# EAGLE design STM_TEST (EAGLE 8.6.1)

## Sheet 1 of 3: STM, EEPROM, CAN TRANCIEVER
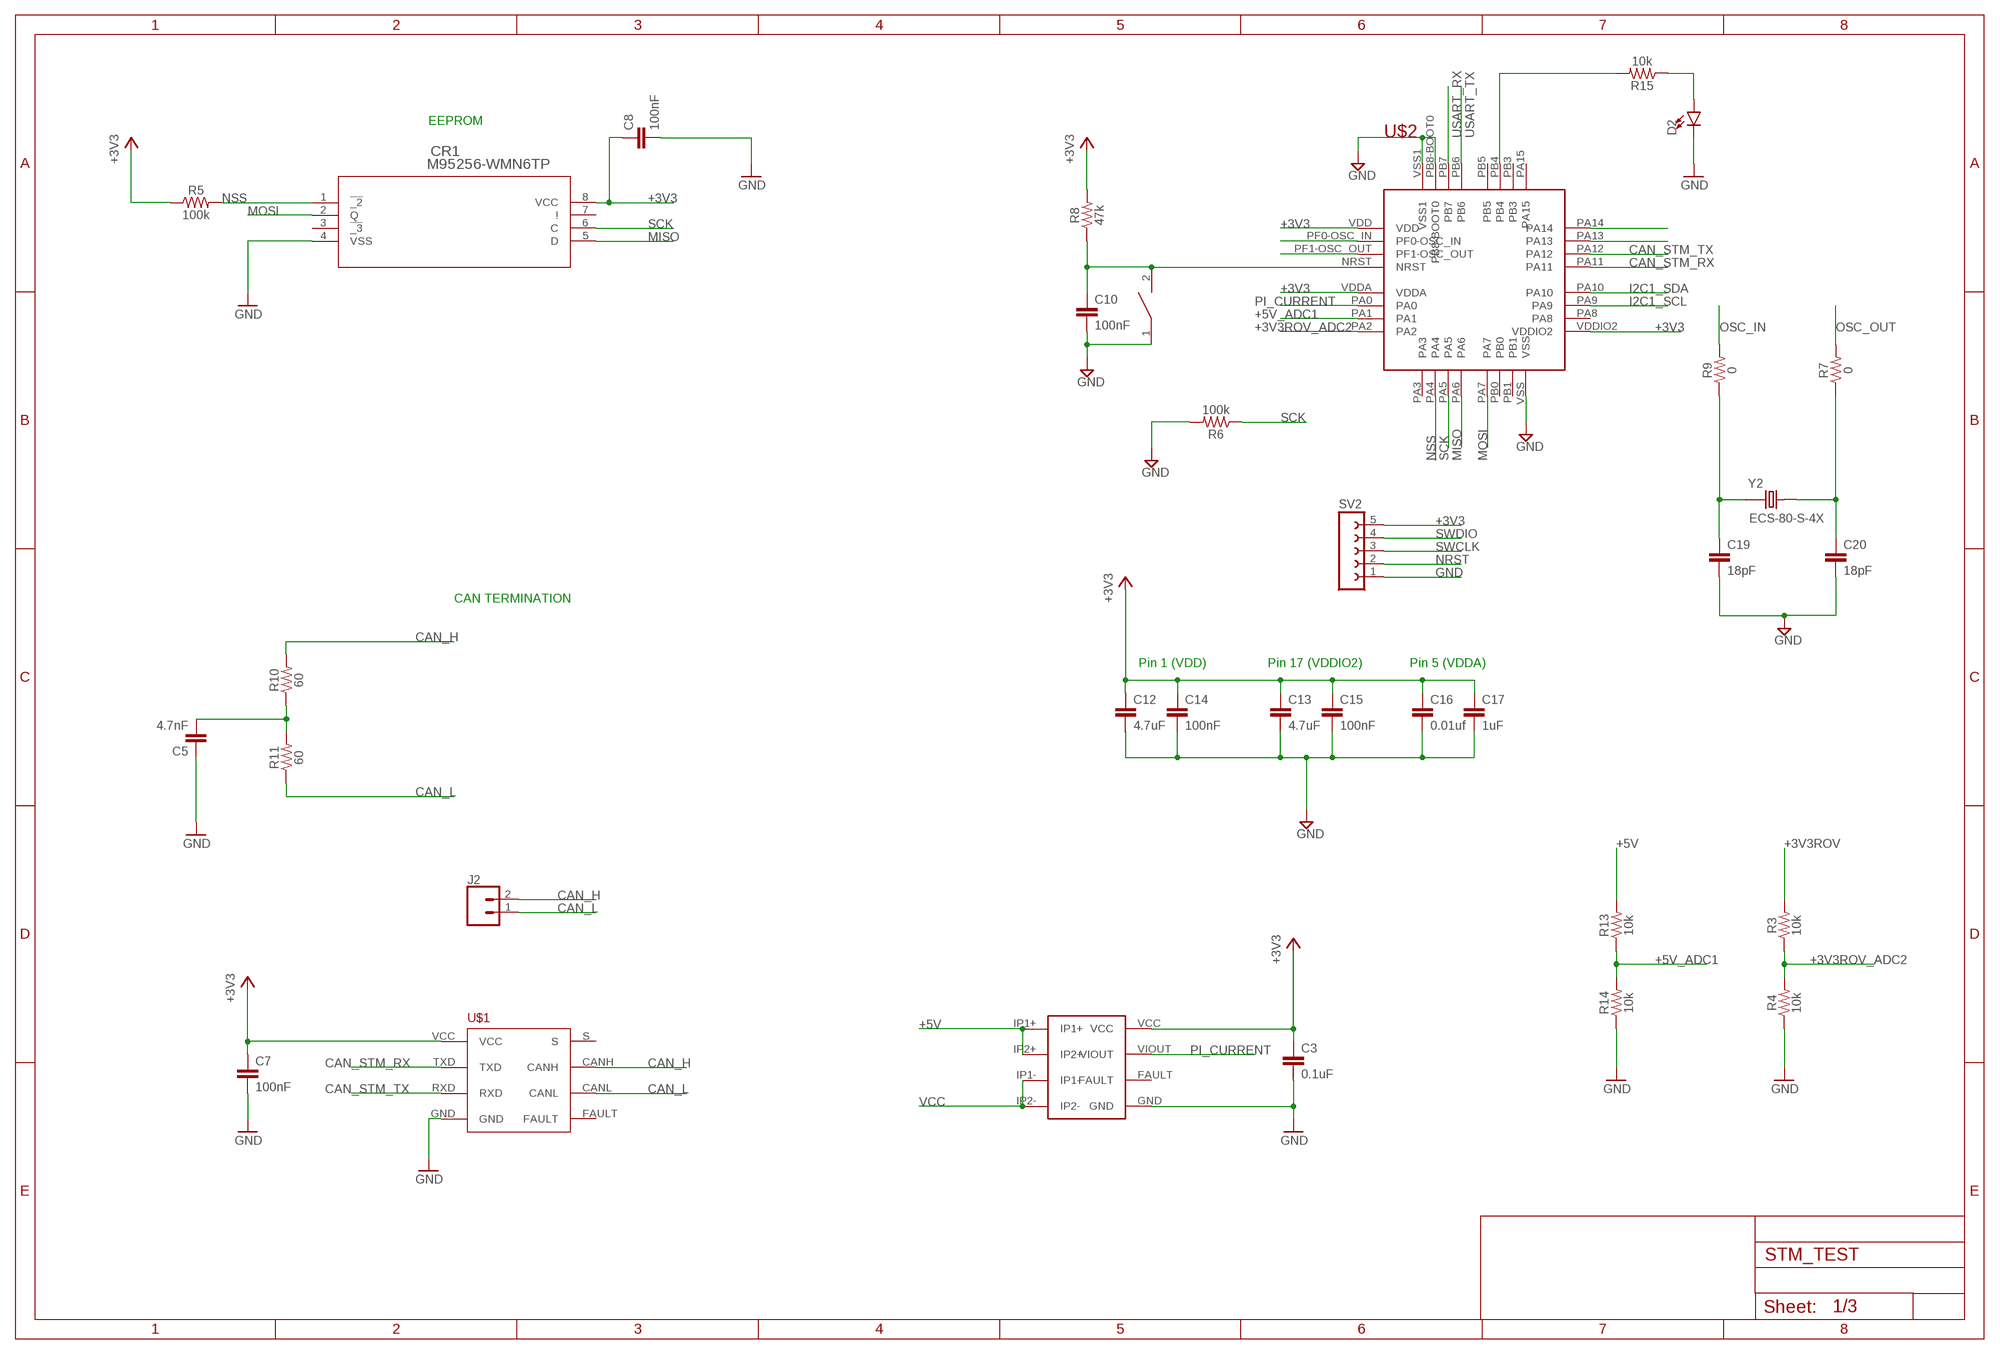
[diagram p0: schematic, sheet 1]

### Parts
C3  0.1uF  4.7UF0603  [0603]
C5  4.7nF  0.1UF-0603-25V-(+80/-20%)  [0603]
C7  100nF  4.7UF0603  [0603]
C8  100nF  4.7UF0603  [0603]
C10  100nF  4.7UF0603  [0603]
C12  4.7uF  4.7UF0603  [0603]
C13  4.7uF  4.7UF0603  [0603]
C14  100nF  4.7UF0603  [0603]
C15  100nF  4.7UF0603  [0603]
C16  0.01uf  4.7UF0603  [0603]
C17  1uF  4.7UF0603  [0603]
C19  18pF  4.7UF0603  [0603]
C20  18pF  4.7UF0603  [0603]
CR1  M95256-WMN6TP  [SO-8]
D2  LED0603  [LED-0603]
J2  CONN_02  [1X02]
R3  10k  1KOHM-0603-1/10W-1%  [0603]
R4  10k  1KOHM-0603-1/10W-1%  [0603]
R5  100k  1KOHM-0603-1/10W-1%  [0603]
R6  100k  1KOHM-0603-1/10W-1%  [0603]
R7  0  1KOHM-0603-1/10W-1%  [0603]
R8  47k  1KOHM-0603-1/10W-1%  [0603]
R9  0  1KOHM-0603-1/10W-1%  [0603]
R10  60  1KOHM-0603-1/10W-1%  [0603]
R11  60  1KOHM-0603-1/10W-1%  [0603]
R13  10k  1KOHM-0603-1/10W-1%  [0603]
R14  10k  1KOHM-0603-1/10W-1%  [0603]
R15  10k  100KOHM-0603-1/10W-1%  [0603]
RESET1  SWITCH  [SW_2512]
SV2  FE05-1  [FE05-1]
U$1  TCAN337D  [TCAN337D]
U$2  STM32F042K6T6  [STM32F042K6T6]
U$4  ACS711  [ACS711]
Y2  ECS-80-S-4X  [XTAL_ECS-80-S-4X]

### Nets
+3V3: C3.1 C7.1 C8.1 C12.1 C13.1 C14.1 C15.1 C16.1 C17.1 CR1.8(VCC) R5.1 R8.2 SV2.5 U$1.VCC U$2.VDD U$2.VDDA U$2.VDDIO2 U$4.VCC ; also sheet 2,3
+3V3ROV: R3.2 ; also sheet 2
+3V3ROV_ADC2: R3.1 R4.2 U$2.PA2
+5V: R13.2 U$4.IP1+ U$4.IP2+ ; also sheet 3
+5V_ADC1: R13.1 R14.2 U$2.PA1
CAN_H: J2.2 R10.2 U$1.CANH ; also sheet 3
CAN_L: J2.1 R11.1 U$1.CANL ; also sheet 3
CAN_STM_RX: U$1.TXD U$2.PA11
CAN_STM_TX: U$1.RXD U$2.PA12
GND: C3.2 C5.1 C7.2 C8.2 C10.2 C12.2 C13.2 C14.2 C15.2 C16.2 C17.2 C19.2 C20.2 CR1.4(VSS) D2.C R4.1 R6.2 R14.1 RESET1.1 SV2.1 U$1.GND U$2.PB8-BOOT0 U$2.VSS U$2.VSS1 U$4.GND ; also sheet 2,3
I2C1_SCL: U$2.PA9 ; also sheet 3
I2C1_SDA: U$2.PA10 ; also sheet 3
MISO: CR1.5(D) U$2.PA6
MOSI: CR1.2(Q) U$2.PA7
N$1: C5.2 R10.1 R11.2
N$4: D2.A R15.1
N$5: R15.2 U$2.PB4
N$6: C20.1 R7.1 Y2.2
N$7: C19.1 R9.1 Y2.1
NRST: C10.1 R8.1 RESET1.2 SV2.2 U$2.NRST
NSS: CR1.1(!_2) R5.2 U$2.PA4
OSC_IN: R9.2 U$2.PF0-OSC_IN
OSC_OUT: R7.2 U$2.PF1-OSC_OUT
PI_CURRENT: U$2.PA0 U$4.VIOUT
SCK: CR1.6(C) R6.1 U$2.PA5
SWCLK: SV2.3 U$2.PA14
SWDIO: SV2.4 U$2.PA13
USART_RX: U$2.PB7 ; also sheet 3
USART_TX: U$2.PB6 ; also sheet 3
VCC: U$4.IP1- U$4.IP2- ; also sheet 2
Unconnected: CR1.3(!_3) CR1.7(!) U$1.FAULT U$1.S U$2.PA3 U$2.PA8 U$2.PA15 U$2.PB0 U$2.PB1 U$2.PB3 U$2.PB5 U$4.FAULT

### Notes on the sheet
- EEPROM
- CAN TERMINATION
- Pin 1 (VDD) | Pin 17 (VDDIO2) | Pin 5 (VDDA)

## Sheet 2 of 3: POWER
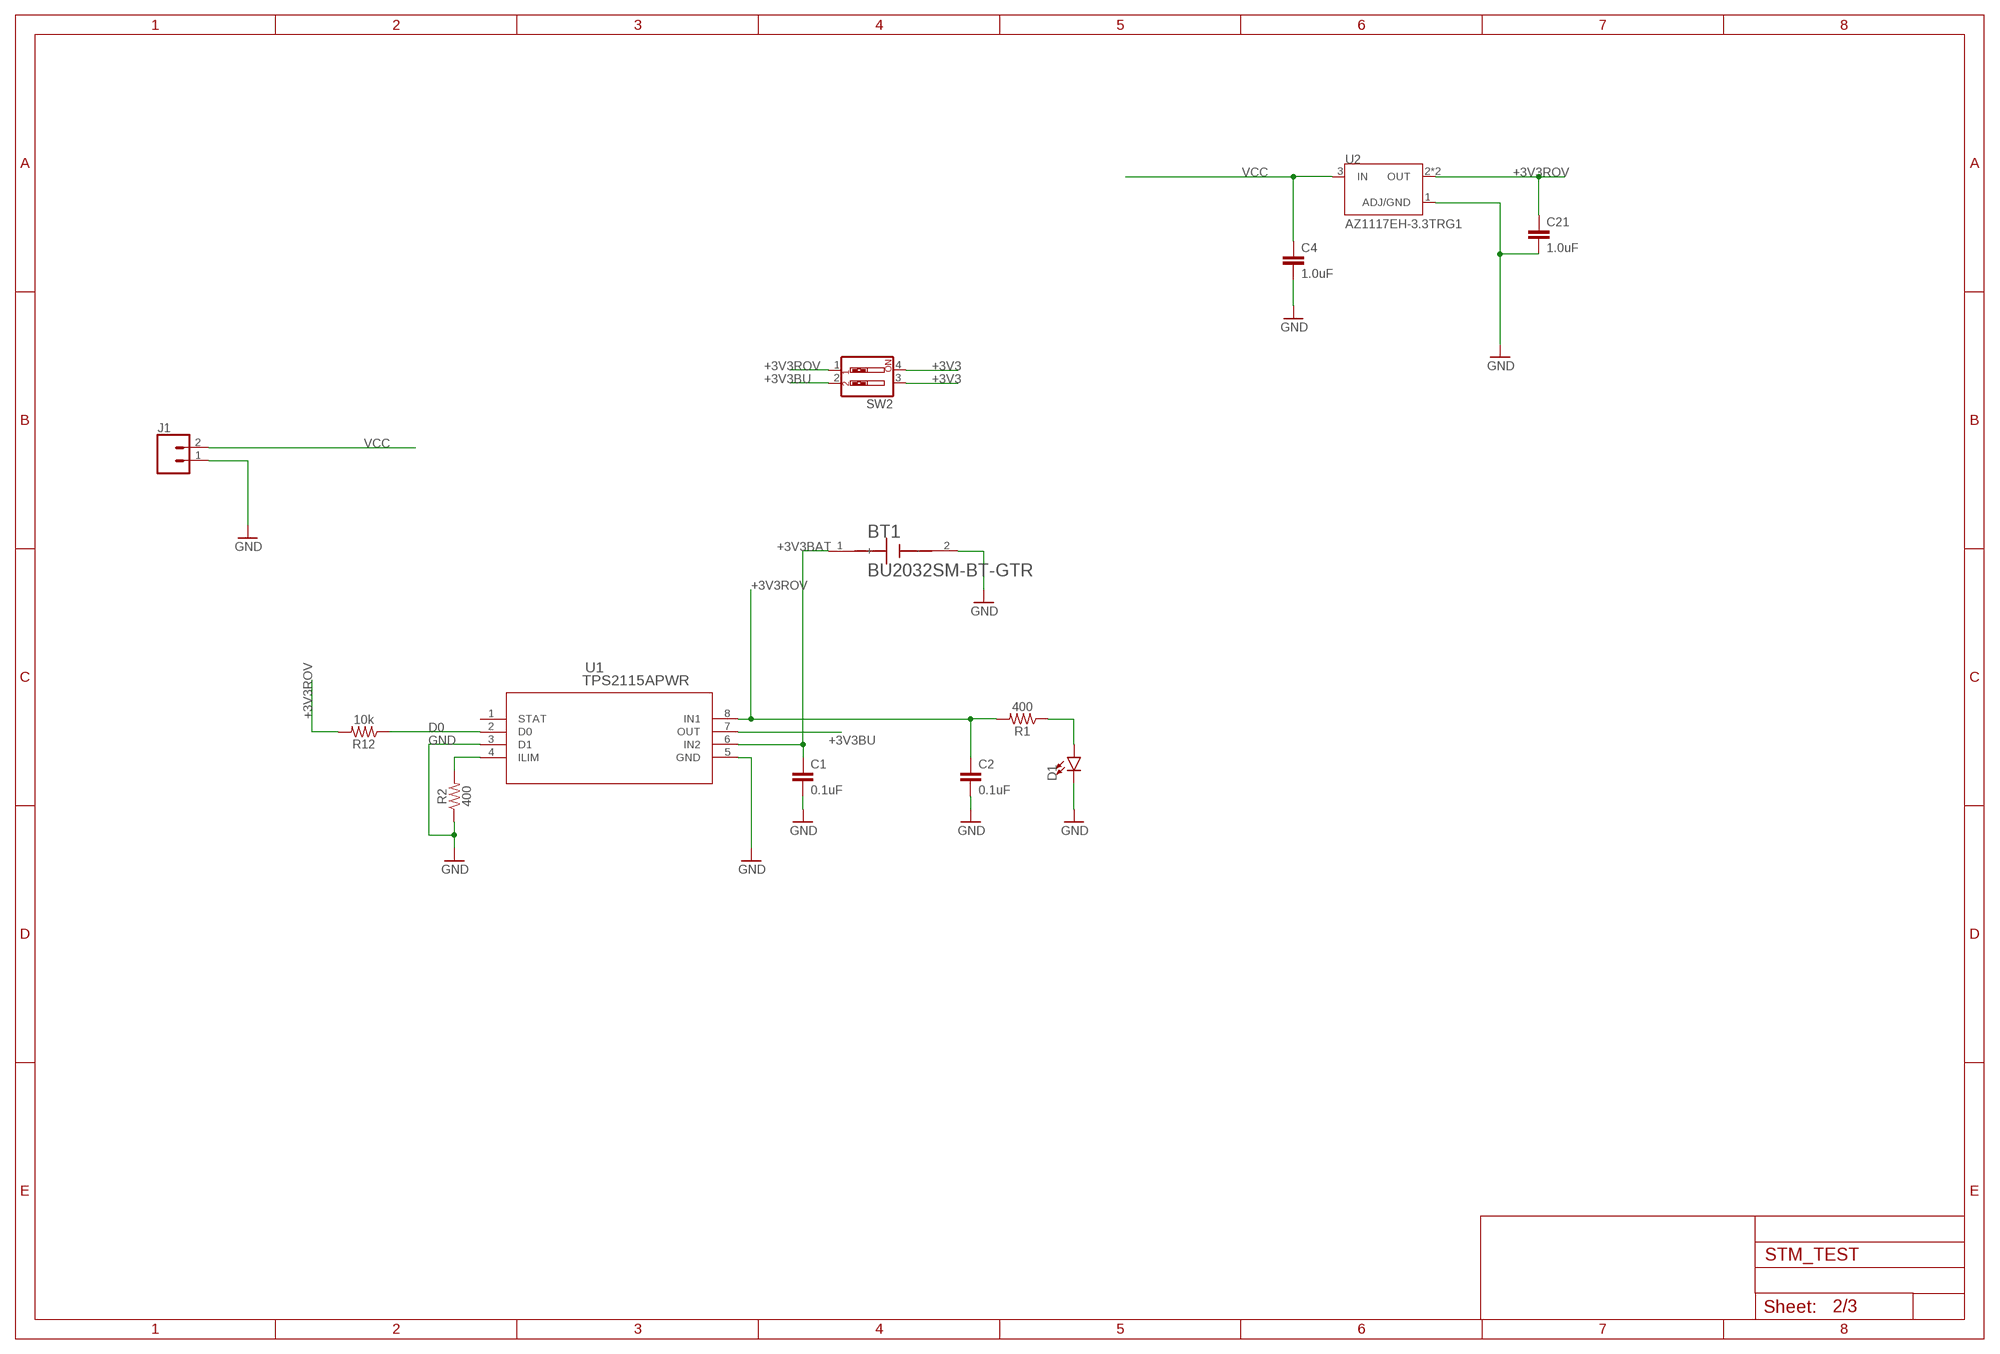
[diagram p1: schematic, sheet 2]

### Parts
BT1  BU2032SM-BT-GTR  [BAT_BU2032SM-BT-GTR]
C1  0.1uF  0.1UF-0603-25V-(+80/-20%)  [0603]
C2  0.1uF  0.1UF-0603-25V-(+80/-20%)  [0603]
C4  1.0uF  1.0UF-0603-16V-10%  [0603]
C21  1.0uF  1.0UF-0603-16V-10%  [0603]
D1  LED0603  [LED-0603]
J1  CONN_02  [1X02]
R1  400  100KOHM-0603-1/10W-1%  [0603]
R2  400  100KOHM-0603-1/10W-1%  [0603]
R12  10k  100KOHM-0603-1/10W-1%  [0603]
SW2  SW_DIP-2  [EDG-02]
U1  TPS2115APWR  [PW8]
U2  AZ1117EH-3.3TRG1  [SOT230P700X180-4N]

### Nets
+3V3: SW2.3 SW2.4 ; also sheet 1,3
+3V3BAT: BT1.1(+) C1.1 U1.6(IN2)
+3V3BU: SW2.2 U1.7(OUT)
+3V3ROV: C2.1 C21.1 R1.2 R12.2 SW2.1 U1.8(IN1) U2.2(OUT) U2.4(OUT) ; also sheet 1
D0: R12.1 U1.2(D0)
GND: BT1.2(-) C1.2 C2.2 C4.2 C21.2 D1.C J1.1 R2.1 U1.3(D1) U1.5(GND) U2.1(ADJ/GND) ; also sheet 1,3
N$2: R2.2 U1.4(ILIM)
N$3: D1.A R1.1
VCC: C4.1 J1.2 U2.3(IN) ; also sheet 1
Unconnected: U1.1(STAT)

## Sheet 3 of 3: PI 2
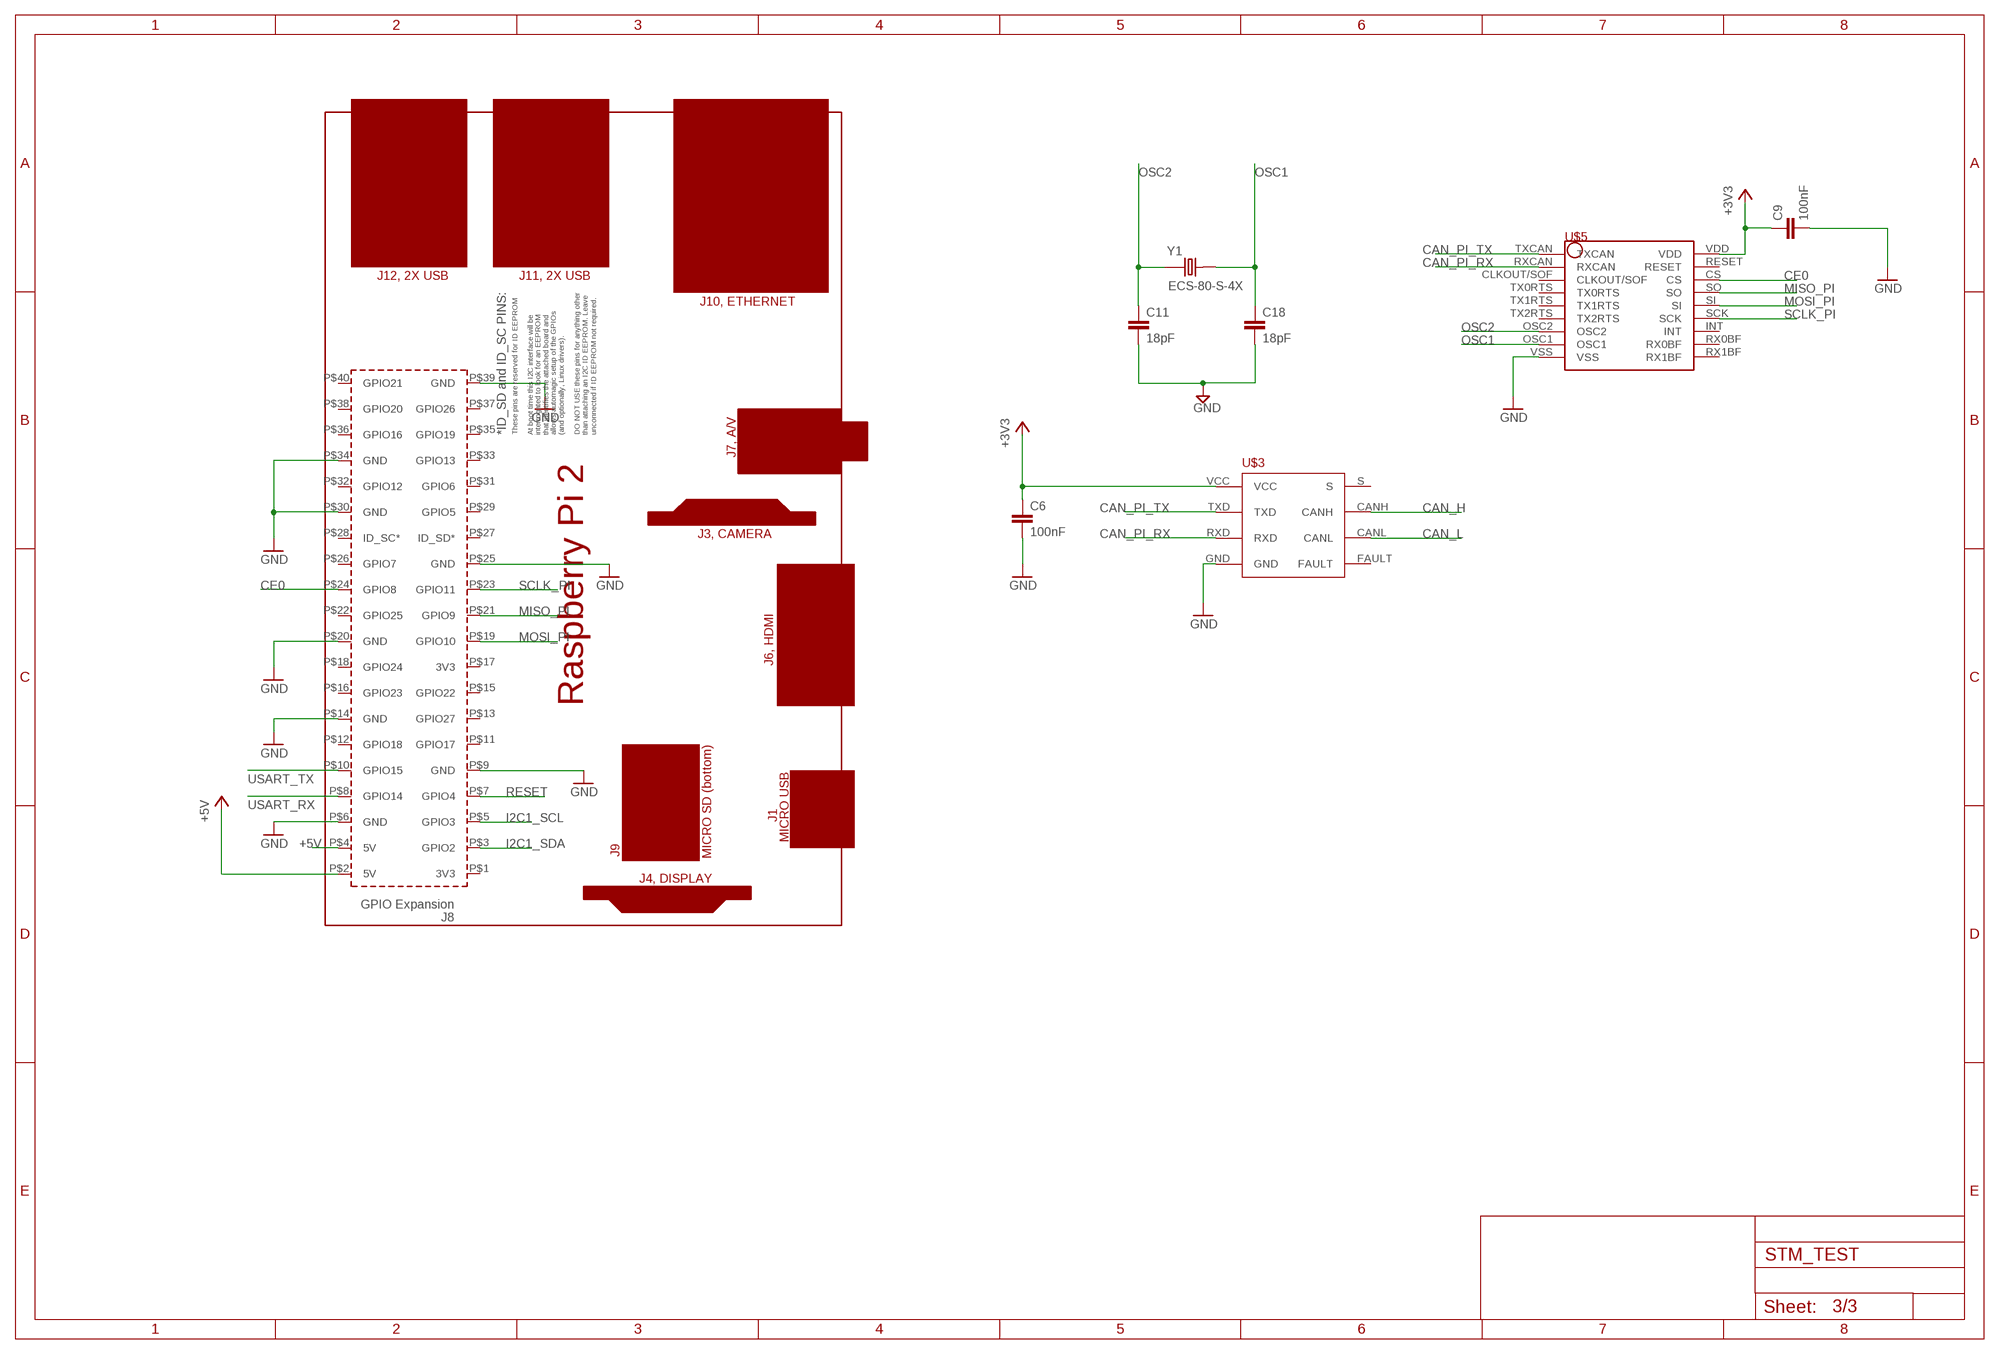
[diagram p2: schematic, sheet 3]

### Parts
C6  100nF  4.7UF0603  [0603]
C9  100nF  4.7UF0603  [0603]
C11  18pF  4.7UF0603  [0603]
C18  18pF  4.7UF0603  [0603]
PCB1  RPI2  [RPI2]
U$3  TCAN337D  [TCAN337D]
U$5  MCP2515  [MCP2515]
Y1  ECS-80-S-4X  [XTAL_ECS-80-S-4X]

### Nets
+3V3: C6.1 C9.1 U$3.VCC U$5.VDD ; also sheet 1,2
+5V: PCB1.P$2(5V) PCB1.P$4(5V) ; also sheet 1
CAN_H: U$3.CANH ; also sheet 1
CAN_L: U$3.CANL ; also sheet 1
CAN_PI_RX: U$3.RXD U$5.RXCAN
CAN_PI_TX: U$3.TXD U$5.TXCAN
CE0: PCB1.P$24(GPIO8) U$5.CS
GND: C6.2 C9.2 C11.2 C18.2 PCB1.P$6(GND) PCB1.P$9(GND) PCB1.P$14(GND) PCB1.P$20(GND) PCB1.P$25(GND) PCB1.P$30(GND) PCB1.P$34(GND) PCB1.P$39(GND) U$3.GND U$5.VSS ; also sheet 1,2
I2C1_SCL: PCB1.P$5(GPIO3) ; also sheet 1
I2C1_SDA: PCB1.P$3(GPIO2) ; also sheet 1
MISO_PI: PCB1.P$21(GPIO9) U$5.SO
MOSI_PI: PCB1.P$19(GPIO10) U$5.SI
OSC1: C18.1 U$5.OSC1 Y1.2
OSC2: C11.1 U$5.OSC2 Y1.1
RESET: PCB1.P$7(GPIO4)
SCLK_PI: PCB1.P$23(GPIO11) U$5.SCK
USART_RX: PCB1.P$8(GPIO14) ; also sheet 1
USART_TX: PCB1.P$10(GPIO15) ; also sheet 1
Unconnected: PCB1.P$1(3V3) PCB1.P$11(GPIO17) PCB1.P$12(GPIO18) PCB1.P$13(GPIO27) PCB1.P$15(GPIO22) PCB1.P$16(GPIO23) PCB1.P$17(3V3) PCB1.P$18(GPIO24) PCB1.P$22(GPIO25) PCB1.P$26(GPIO7) PCB1.P$27(ID_SD*) PCB1.P$28(ID_SC*) PCB1.P$29(GPIO5) PCB1.P$31(GPIO6) PCB1.P$32(GPIO12) PCB1.P$33(GPIO13) PCB1.P$35(GPIO19) PCB1.P$36(GPIO16) PCB1.P$37(GPIO26) PCB1.P$38(GPIO20) PCB1.P$40(GPIO21) U$3.FAULT U$3.S U$5.CLKOUT/SOF U$5.INT U$5.RESET U$5.RX0BF U$5.RX1BF U$5.TX0RTS U$5.TX1RTS U$5.TX2RTS

## Library data of the parts
BT1 = BU2032SM-BT-GTR:BU2032SM-BT-GTR: Holder Cr2032 Gold Leads Smd; DESCRIPTION: Holder Cr2032 Gold Leads Smd; DIGI-KEY_PART_NUMBER: BU2032SM-BT-GCT-ND; DIGI-KEY_PURCHASE_URL: https://www.digikey.com/product-detail/en/mpd-memory-protection-devices/BU2032SM-BT-GTR/BU2032SM-BT-GCT-ND/3628531?utm_source=snapeda&utm_medium=aggregator&utm_campaign=symbol; MF: MPD; MP: BU2032SM-BT-GTR; PACKAGE: None
C1 C2 = SparkFun-Capacitors:0.1UF: 0.1µF ceramic capacitors A capacitor is a passive two-terminal electrical component used to store electrical energy temporarily in an electric field.; PROD_ID: CAP-00810
C3 C6-C11 C14-C20 = SparkFun-Capacitors:4.7UF: 4.7µF ceramic capacitors A capacitor is a passive two-terminal electrical component used to store electrical energy temporarily in an electric field.; PROD_ID: CAP-08280; VALUE: 4.7uF
C4 C21 = SparkFun-Capacitors:1.0UF: 1µF ceramic capacitors A capacitor is a passive two-terminal electrical component used to store electrical energy temporarily in an electric field.; PROD_ID: CAP-00868
C5 = SparkFun-Capacitors:0.1UF: 0.1µF ceramic capacitors A capacitor is a passive two-terminal electrical component used to store electrical energy temporarily in an electric field.; PROD_ID: CAP-00810; VALUE: 0.1uF
C12 C13 = SparkFun-Capacitors:4.7UF: 4.7µF ceramic capacitors A capacitor is a passive two-terminal electrical component used to store electrical energy temporarily in an electric field.; PROD_ID: CAP-08280
CR1 = M95256:M95256-WMN6TP; MANUFACTURER_PART_NUMBER: M95256WMN6TP; VENDOR: STMicroelectronics
D1 D2 = SparkFun-LED:LED: LED (Generic) Standard schematic elements and footprints for 5mm, 3mm, 1206, and 0603 sized LEDs. Generic LEDs with no color specified.
J1 J2 = SparkFun-Connectors:CONN_02: Multi connection point. Often used as Generic Header-pin footprint for 0.1 inch spaced/style header connections On any of the 0.1 inch spaced packages, you can populate with these: Break Away Headers - Straight <https://www.sparkfun.com/products/116> (PRT-00116) Break Away Male Headers - Right Angle <https://www.sparkfun.com/products/553> (PRT-00553) Female Headers <https://www.sparkfun.com/products/115> (PRT-00115) Break Away Headers - Machine Pin <https://www.sparkfun.com/products/117> (PRT-00117) Break Away Female Headers - Swiss Machine Pin <https://www.sparkfun.com/products/743> (PRT-00743) For SCREWTERMINALS and SPRING TERMINALS visit here: Screw Terimnals on SparkFun.com <https://www.sparkfun.com/search/results?term=Screw+Terminals> (5mm/3.5mm/2.54mm spacing) This device is also useful as a general connection point to wire up your design to another part of your project. Our various solder wires solder well into these plated through hole pads. Hook-Up Wire - Assortment (Stranded, 22 AWG) <https://www.sparkfun.com/products/11375> (PRT-11375) Hook-Up Wire - Assortment (Solid Core, 22 AWG) <https://www.sparkfun.com/products/11367> (PRT-11367) View the entire wire category on our website here <https://www.sparkfun.com/categories/141> Special notes: Molex polarized connector foot print use with: PRT-08233 with associated crimp pins and housings. 2.54_SCREWTERM for use with PRT-10571. 3.5mm Screw Terminal footprints for PRT-08084 5mm Screw Terminal footprints for use with PRT-08432
PCB1 = MicrocontrollerComponents:RPI2: Device for Raspberry Pi 2 board created by www.element14.com More information and support community is available at http://www.element14.com/community/community/raspberry-pi/raspberrypi2
R1 R2 R12 R15 = SparkFun-Resistors:100KOHM: 100kΩ resistor A resistor is a passive two-terminal electrical component that implements electrical resistance as a circuit element. Resistors act to reduce current flow, and, at the same time, act to lower voltage levels within circuits. - Wikipedia; PROD_ID: RES-07828; VALUE: 100k
R3-R11 R13 R14 = SparkFun-Resistors:1KOHM: 1kΩ resistor A resistor is a passive two-terminal electrical component that implements electrical resistance as a circuit element. Resistors act to reduce current flow, and, at the same time, act to lower voltage levels within circuits. - Wikipedia; PROD_ID: RES-07856; VALUE: 1k
RESET1 = DiscreteComponents:SWITCH
SV2 = con-lsta:FE05-1: FEMALE HEADER; OC_FARNELL: unknown; OC_NEWARK: unknown
SW2 = special:SW_DIP-2: DIP SWITCH
U1 = TPS115A:TPS2115APWR; MANUFACTURER_PART_NUMBER: TPS2115APWR; VENDOR: Texas Instruments
U2 = AZ1117EH-3.3TRG1:AZ1117EH-3.3TRG1: Ldo.Vreg Pos 3, 3v 1a Sot223; AVAILABILITY: Unavailable; DESCRIPTION: Ldo.Vreg Pos 3, 3v 1a Sot223; MF: Diodes Inc.; MP: AZ1117EH-3.3TRG1; PACKAGE: SOT-223 Diodes Inc.; PRICE: None
U$1 U$3 = PI_Shield_Library:TCAN337D
U$2 = PI_Shield_Library:STM32F042K6T6
U$4 = ACS711_ameter:ACS711
U$5 = PI_Shield_Library:MCP2515
Y1 Y2 = ECS-80-S-4X:ECS-80-S-4X: CRYSTAL T/H; DESCRIPTION: Crystal 8MHz Series 2-Pin HC-49/U; DIGI-KEY_PART_NUMBER: X1057-ND; DIGI-KEY_PURCHASE_URL: https://www.digikey.com/product-detail/en/ecs-inc/ECS-80-S-4X/X1057-ND/827549?utm_source=snapeda&utm_medium=aggregator&utm_campaign=symbol; MF: ECS International; MP: ECS-80-S-4X; PACKAGE: HC-49/US ECS International

## Board
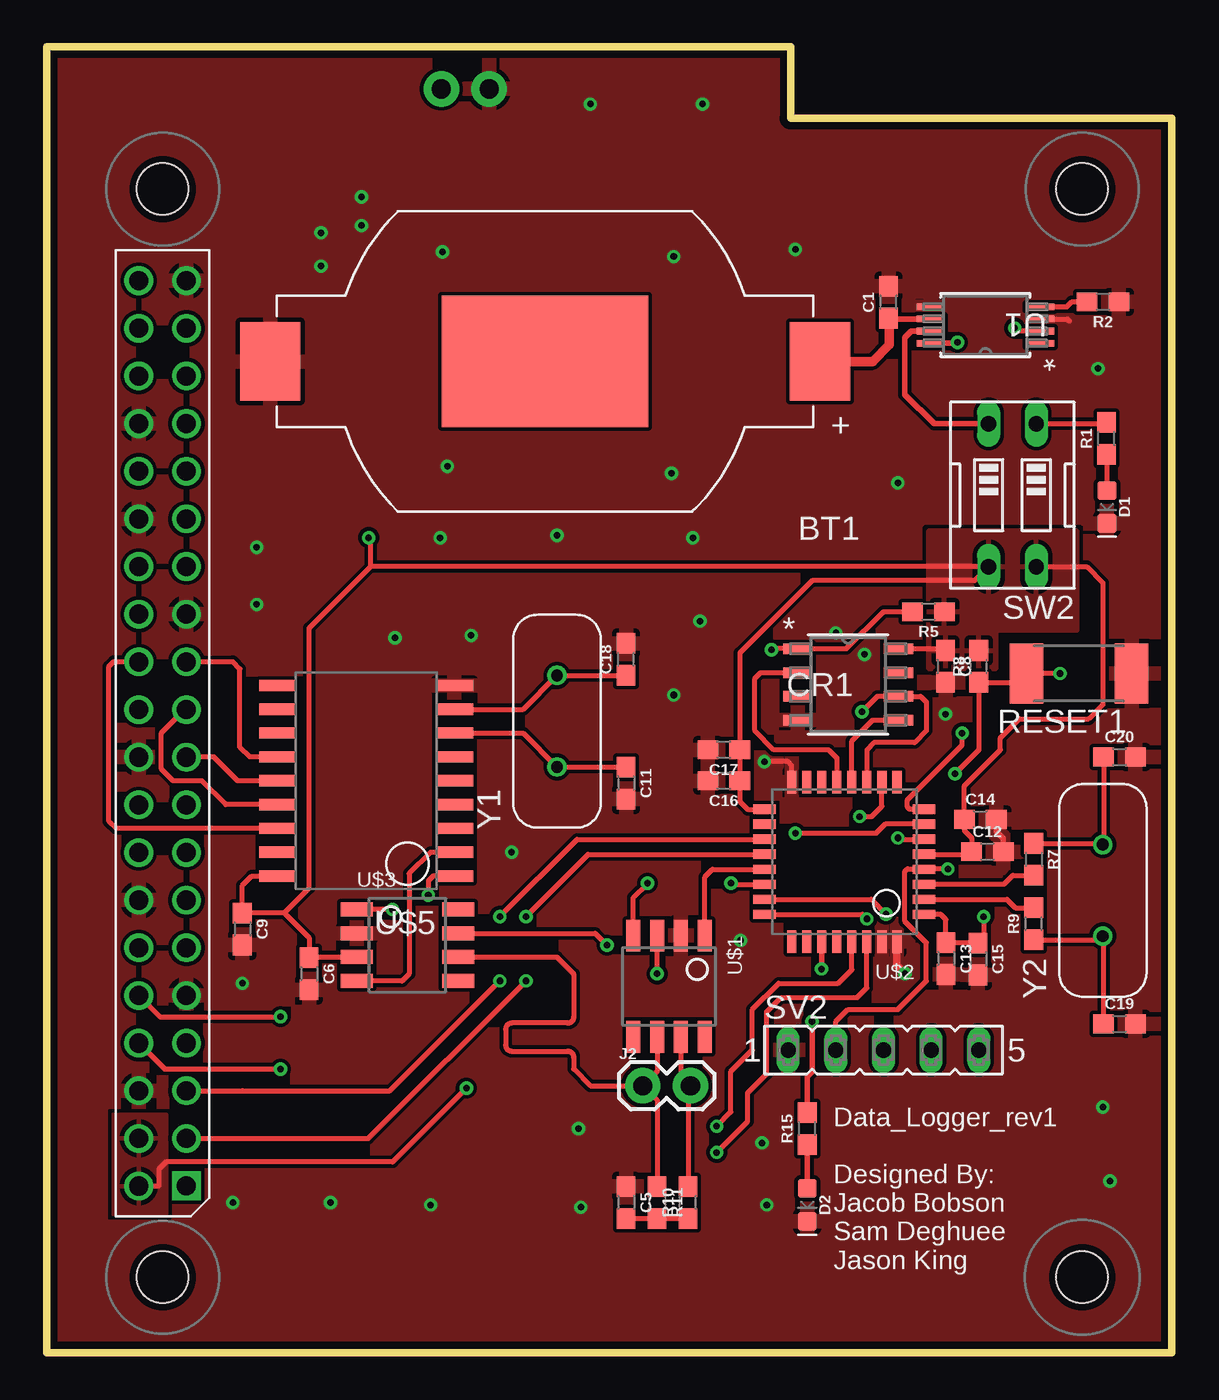
[diagram p3: board, top side]
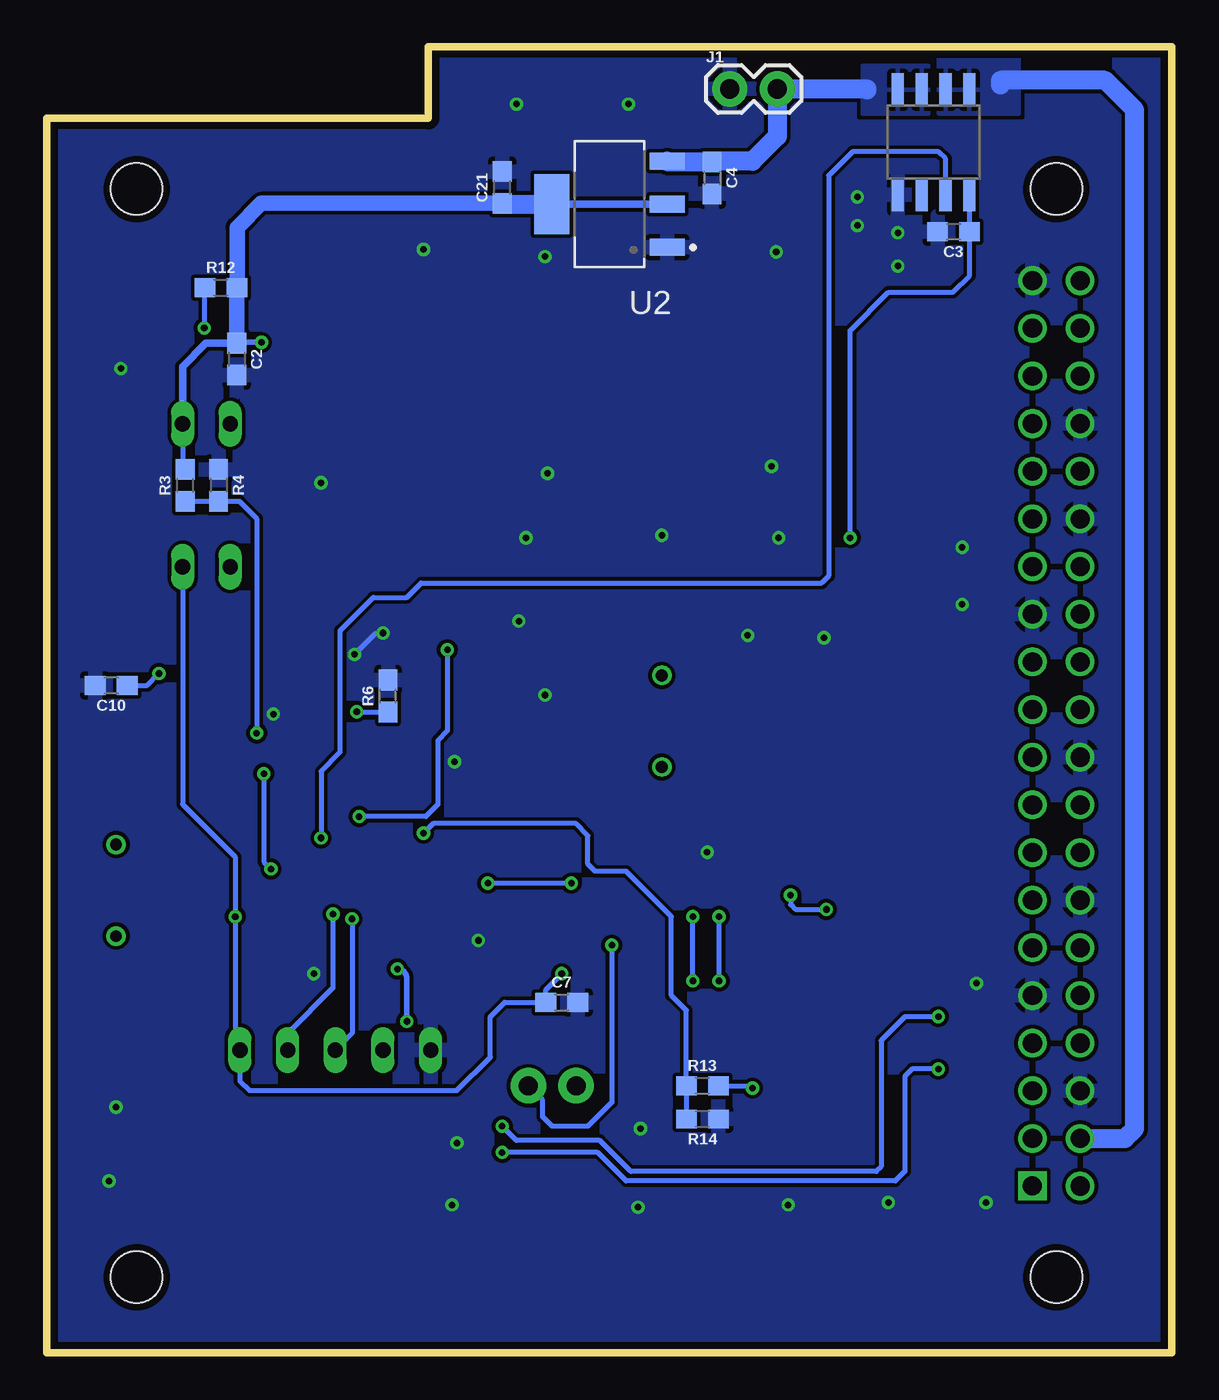
[diagram p4: board, bottom side, seen from below]

Size 59.94 x 69.6 mm. Coordinates in mm from the lower left corner, seen from the top.
Outline: 0,69.6 39.62,69.6 39.62,65.79 59.94,65.79 59.94,0 0,0 0,69.6
Copper layers (1*16): Top 0.0356mm / dielectric 1.5011mm / Bottom 0.0356mm
Design rules "ECE_DRC": minimum track width 8mil, minimum drill 13mil, track to track 8mil, track to pad 8mil, pad to pad 6mil, via to via 8mil, smd to smd 6mil, copper to edge 15mil, drill to drill 8mil, minimum pad ring 7mil, minimum via ring 7mil, stop-mask expansion 3mil, vias tented up to drill 0mil, thermal gap 10mil

### Footprints (pad centres in the part's own frame; a part is rotated, then mirrored left to right if it is on the bottom)
BAT_BU2032SM-BT-GTR = smd 3.2 x 4.2: 1 -14.65,0; 2 14.65,0 | smd 11 x 7: 3 0,0
0603 = smd 1.1 x 1: 1 -0.85,0; 2 0.85,0
SO-8 = smd 1.549 x 0.559: 1 -2.68,1.905; 2 -2.68,0.635; 3 -2.68,-0.635; 4 -2.68,-1.905; 5 2.68,-1.905; 6 2.68,-0.635; 7 2.68,0.635; 8 2.68,1.905
LED-0603 = smd 1 x 1: A -0.877,0; C 0.877,0
1X02 = drill 1.016 pad 1.88: 1 0,0; 2 2.54,0
RPI2 = drill 1.016 square: P$1 8.37,51.23 | drill 1.016: P$2 8.357,53.772; P$3 10.897,51.232; P$4 10.897,53.772; P$5 13.437,51.232; P$6 13.437,53.772; P$7 15.977,51.232; P$8 15.977,53.772; P$9 18.517,51.232; P$10 18.517,53.772; P$11 21.057,51.232; P$12 21.057,53.772; P$13 23.597,51.232; P$14 23.597,53.772; P$15 26.137,51.232; P$16 26.137,53.772; P$17 28.677,51.232; P$18 28.677,53.772; P$19 31.217,51.232; P$20 31.217,53.772; P$21 33.757,51.232; P$22 33.757,53.772; P$23 36.297,51.232; P$24 36.297,53.772; P$25 38.837,51.232; P$26 38.837,53.772; P$27 41.377,51.232; P$28 41.377,53.772; P$29 43.917,51.232; P$30 43.917,53.772; P$31 46.457,51.232; P$32 46.457,53.772; P$33 48.997,51.232; P$34 48.997,53.772; P$35 51.537,51.232; P$36 51.537,53.772; P$37 54.077,51.232; P$38 54.077,53.772; P$39 56.617,51.232; P$40 56.617,53.772 | hole 2.75: 3.5,3.5; 61.5,3.5; 3.5,52.5; 61.5,52.5
SW_2512 = smd 1.8 x 3.2: 1 -2.8,0; 2 2.8,0
FE05-1 = drill 0.813 long: 1 -5.08,0; 2 -2.54,0; 3 0,0; 4 2.54,0; 5 5.08,0
EDG-02 = drill 0.813 long: 1 -1.27,-3.81; 2 1.27,-3.81; 3 1.27,3.81; 4 -1.27,3.81
PW8 = smd 1.473 x 0.356: 1 -2.921,0.975; 2 -2.921,0.325; 3 -2.921,-0.325; 4 -2.921,-0.975; 5 2.921,-0.975; 6 2.921,-0.325; 7 2.921,0.325; 8 2.921,0.975
SOT230P700X180-4N = smd 1.86 x 0.9: 1 -3.075,2.3; 2 -3.075,0; 3 -3.075,-2.3 | smd 1.86 x 3.19: 4 3.075,0
TCAN337D = smd 1.7 x 0.75: CANH 5.4,2.54; CANL 5.4,1.27; FAULT 5.4,0; GND 0,2.54; RXD 0,0; S 5.4,3.81; TXD 0,3.81; VCC 0,1.27
STM32F042K6T6 = smd 1.2 x 0.5: NRST 0,3.2; PA0 0,1.6; PA1 0,0.8; PA2 0,0; PA8 8.5,0.8; PA9 8.5,1.6; PA10 8.5,2.4; PA11 8.5,3.2; PA12 8.5,4; PA13 8.5,4.8; PA14 8.5,5.6; PF0-OSC_IN 0,4.8; PF1-OSC_OUT 0,4; VDD 0,5.6; VDDA 0,2.4; VDDIO2 8.5,0 | smd 0.5 x 1.2: PA3 1.45,-1.45; PA4 2.25,-1.45; PA5 3.05,-1.45; PA6 3.85,-1.45; PA7 4.65,-1.45; PA15 7.05,7.05; PB0 5.45,-1.45; PB1 6.25,-1.45; PB3 6.25,7.05; PB4 5.45,7.05; PB5 4.65,7.05; PB6 3.85,7.05; PB7 3.05,7.05; PB8-BOOT0 2.25,7.05; VSS 7.05,-1.45; VSS1 1.45,7.05
ACS711 = smd 1.75 x 0.65: FAULT 2.8,-0.635; GND 2.8,-1.905; IP1+ -2.8,1.905; IP1- -2.8,-0.635; IP2+ -2.8,0.635; IP2- -2.8,-1.905; VCC 2.8,1.905; VIOUT 2.8,0.635
MCP2515 = smd 2 x 0.6: CLKOUT/SOF 0,7.62; CS 9.4,7.62; INT 9.4,2.54; OSC1 0,1.27; OSC2 0,2.54; RESET 9.4,8.89; RX0BF 9.4,1.27; RX1BF 9.4,0; RXCAN 0,8.89; SCK 9.4,3.81; SI 9.4,5.08; SO 9.4,6.35; TX0RTS 0,6.35; TX1RTS 0,5.08; TX2RTS 0,3.81; TXCAN 0,10.16; VDD 9.4,10.16; VSS 0,0
XTAL_ECS-80-S-4X = drill 0.63 pad 1.03: 1 -2.44,0; 2 2.44,0

### Placement (x,y rotation side)
BT1  26.54,52.83 180 top
C1  44.85,55.98 90 top
C2  49.83,52.96 270 bottom
C3  11.63,59.74 180 bottom
C4  24.51,62.61 270 bottom
C5  30.86,8 270 top
C6  13.97,20.19 270 top
C7  32.51,18.67 0 bottom
C8  47.88,36.58 270 top
C9  10.41,22.58 270 top
C10  56.52,35.56 180 bottom
C11  30.86,30.35 270 top
C12  50.11,26.7 0 top
C13  47.9,21.01 270 top
C14  49.73,28.42 0 top
C15  49.61,20.98 270 top
C16  36.07,30.48 180 top
C17  36.07,32.13 180 top
C18  30.86,36.96 90 top
C19  57.15,17.53 0 top
C20  57.15,31.75 0 top
C21  35.69,62.1 90 bottom
CR1  42.69,35.61 0 top
D1  56.48,45.08 270 top
D2  40.51,7.87 270 top
J1  23.56,67.35 0 bottom
J2  31.75,14.22 0 top
PCB1  58.66,0.52 90 top
R1  56.46,48.73 90 top
R2  56.27,56.01 180 top
R3  52.58,46.23 90 bottom
R4  50.8,46.23 270 bottom
R5  46.97,39.49 180 top
R6  41.77,35 90 bottom
R7  52.58,26.29 270 top
R8  49.66,36.58 90 top
R9  52.58,22.86 90 top
R10  34.16,8 90 top
R11  32.51,8 270 top
R12  50.67,56.77 0 bottom
R13  25.02,14.22 0 bottom
R14  25.02,12.45 180 bottom
R15  40.51,11.94 90 top
RESET1  54.99,36.2 180 top
SV2  44.58,16.13 0 top
SW2  51.45,45.7 180 top
U1  50.01,54.77 180 top
U2  29.97,61.21 180 bottom
U$1  31.24,22.22 270 top
U$2  46.74,28.96 180 top
U$3  16.51,19.81 0 top
U$4  12.7,64.52 270 bottom
U$5  21.72,35.56 180 top
Y1  27.18,33.66 90 top
Y2  56.26,24.64 90 top

### Tracks (layer width: path | path; a pad name or v marks a point on that pad's centre or on a via)
+3V3  (via drill 0.35)
  Top 0.254: CR1.8 47.88,37.52 C8.1 | 17.25,41.89 SW2.3 49.44,41.15 40.77,41.15 36.92,37.3 C17.1 C16.1 36.92,29.38 37.34,28.96 U$2.VDDIO2 | 17.25,41.89 13.97,38.61 13.97,24.76 12.64,23.43 | 12.64,23.43 C9.1 10.41,24.89 10.92,25.4 U$5.VDD | 12.64,23.43 13.97,22.1 C6.1 14.01,21.08 U$3.VCC | U$2.VDD 47.61,23.36 47.62,23.37 47.9,23.09 C13.1 49.58,21.86 C15.1 49.91,22.13 v49.91,23.24 | SW2.4 55.4,41.89 56.26,41.02 56.26,34.54 55.5,33.78 51.82,33.78 50.8,32.77 50.8,32.13 48.88,30.21 C14.1 48.88,27.82 49.28,27.43 C12.1 49.12,26.56 U$2.VDDA | v32.51,20.19 U$1.VCC | 17.25,41.89 17.25,43.33 v17.14,43.43
  Bottom 0.254: SW2.4 52.72,29.22 49.91,26.42 v49.91,23.24 49.91,16.38 SV2.5 49.66,14.48 49.15,13.97 38.1,13.97 36.32,15.75 36.32,17.91 35.56,18.67 C7.1 33.36,19.34 v32.51,20.19 | v17.14,43.43 17.14,54.48 15.11,56.52 11.68,56.52 10.78,57.42 C3.1 10.79,59.75 U$4.VCC
  pour Top: 46.99,36.45 46.99,43.82 54.86,43.82 54.86,38.48 50.55,38.48 50.55,36.45
+3V3BAT
  Top 0.305: C1.1 44.89,55.1 U1.6
  Top 0.508: BT1.1 43.99,52.83 44.89,53.73 44.89,55.1
+3V3BU
  Top 0.305: U1.7 46.06,54.45 45.72,54.1 45.72,51.05 47.27,49.51 SW2.2
+3V3ROV  (via drill 0.35)
  Top 0.254: SW2.1 56.39,49.51 R1.2
  Top 0.305: U1.8 48.46,53.8 v48.51,53.85
  Bottom 0.254: SW2.1 52.72,47.22 R3.2
  Bottom 0.305: v48.51,53.85 49.8,53.85 49.82,53.82
  Bottom 0.406: 49.91,56.86 R12.2 | C2.1 51.47,53.81 52.72,52.57 SW2.1 | U2.2 U2.4
  Bottom 0.813: R12.2 49.82,53.82 C2.1 | C21.1 48.53,61.25 49.81,59.97 49.81,56.96 49.91,56.86
  Bottom 1.016: C21.1 35.65,61.21 U2.4
+3V3ROV_ADC2  (via drill 0.35)
  Top 0.254: U$2.PA2 45.97,28.96 45.85,29.08 45.85,29.46 48.77,32.39 v48.77,33.02
  Bottom 0.254: R3.1 R4.2 49.7,45.38 48.77,44.45 v48.77,33.02
+5V  (via drill 0.35)
  Top 0.254: v22.35,14.1 18.41,10.16 6.35,10.16 5.97,9.78 5.97,8.89 5.96,8.88 PCB1.P$2
  Bottom 0.254: R13.2 22.48,14.22 v22.35,14.1
  Bottom 1.016: PCB1.P$4 2.51,11.42 1.98,11.94 1.98,66.24 3.56,67.82 9.14,67.82 9.14,67.56
  pour Top: 3.56,12.7 6.35,12.7 6.35,7.37 3.56,7.37
  pour Bottom: 12.45,69.09 12.45,66.04 8.13,66.04 8.13,69.09
+5V_ADC1  (via drill 0.35)
  Top 0.254: v39.88,27.69 44.2,27.69 44.7,28.19 46.7,28.19 U$2.PA1
  Bottom 0.254: R14.2 R13.1 25.87,18.25 26.67,19.05 26.67,23.24 29.08,25.65 30.73,25.65 31.11,26.04 31.11,27.56 31.75,28.19 39.37,28.19 v39.88,27.69
CAN_H  (via drill 0.35)
  Top 0.254: U$1.CANH 33.78,14.73 J2.2 34.29,13.72 34.16,13.59 R10.2 | U$3.CANH 29.21,22.35 v29.84,21.72
  Bottom 0.254: v29.84,21.72 29.84,13.34 31.11,12.07 33.02,12.07 33.53,12.57 33.53,13.46 J2.2
CAN_L
  Top 0.254: 32.49,16.8 U$1.CANL 32.51,14.99 J2.1 | J2.1 32.51,13.46 R11.1 | U$3.CANL 27.18,21.08 28.07,20.19 28.07,17.88 arc-90 27.75,17.56 24.76,17.56 arc90 24.45,17.24 24.45,16.38 arc90 24.76,16.07 27.75,16.07 arc-90 28.07,15.75 28.07,15.11 28.96,14.22 J2.1
CAN_PI_RX
  Top 0.254: U$5.RXCAN 20.45,26.67 19.3,25.53 19.3,20.19 18.92,19.81 U$3.RXD
CAN_PI_TX  (via drill 0.35)
  Top 0.254: U$5.TXCAN 20.57,25.4 20.32,25.15 v20.32,24.38 | v18.41,23.62 U$3.TXD
  Bottom 0.254: v20.32,24.38 20.32,23.88 20.07,23.62 v18.41,23.62
CAN_STM_RX
  Top 0.254: U$1.TXD 35.05,25.35 35.46,25.76 U$2.PA11 | U$2.PA11
CAN_STM_TX  (via drill 0.35)
  Top 0.254: U$1.RXD 31.24,24.26 v32,25.02 | v36.45,25.02 36.51,24.96 U$2.PA12
  Bottom 0.254: v32,25.02 v36.45,25.02
CE0
  Top 0.254: U$5.CS 3.68,27.94 3.3,28.32 3.3,36.58 3.56,36.83 4.88,36.83 PCB1.P$24
D0  (via drill 0.35)
  Top 0.254: U1.2 51.73,54.45 v51.56,54.61
  Bottom 0.254: v51.56,54.61 51.52,54.65 R12.1
GND  (via drill 0.35)
  Top 0.254: U$2.VSS 39.69,31.31 39.5,31.5 v38.23,31.5 | U1.3 54.38,55.1 54.48,54.99
  Top 0.305: C14.2 50.58,27.78 50.96,27.39 C12.2
  Top 0.406: U$2.VSS1 45.29,20.63 v45.72,20.19
  Bottom 0.254: v43.56,37.21 42.42,38.35 v42.04,38.35
  other vias: 11.18,39.88 11.18,42.93 18.54,38.1 22.61,38.23 20.95,43.43 27.18,43.56 34.42,43.43 34.8,38.99 33.4,35.05 10.41,19.68 9.91,8 15.11,8 20.45,7.87 38.1,11.18 38.35,7.87 56.26,13.08 56.64,9.14 36.96,21.97 24.77,26.67 39.88,58.8 45.34,46.36 56.01,52.45 34.92,66.55 28.96,66.55 21.34,47.24 21.08,58.67 33.4,58.42 33.27,46.86 28.45,7.75 28.32,11.94 47.88,34.04 14.61,59.69 16.76,60.07 16.76,61.59 14.61,57.91
  pour Bottom (rank 3): -0.47,70.02 60.64,70.02 60.39,-0.54 -0.72,-0.54
  pour Top (rank 3): -0.41,-0.41 60.59,-0.41 60.59,70.42 -0.41,70.42
I2C1_SCL  (via drill 0.35)
  Top 0.254: PCB1.P$5 10.41,13.96 18.27,13.96 v24.13,19.81 | v24.13,23.24 28.25,27.36 U$2.PA9
  Bottom 0.254: v24.13,19.81 v24.13,23.24
I2C1_SDA  (via drill 0.35)
  Top 0.254: PCB1.P$3 17.13,11.42 v25.53,19.81 | v25.53,23.24 28.84,26.56 U$2.PA10
  Bottom 0.254: v25.53,19.81 v25.53,23.24
MISO
  Top 0.254: U$2.PA6 42.89,32.6 43.99,33.71 CR1.5
MISO_PI
  Top 0.254: U$5.SO 9.53,29.21 8.25,30.48 6.73,30.48 6.1,31.11 6.1,33.02 7.35,34.28 PCB1.P$21
MOSI
  Top 0.254: U$2.PA7 42.09,31.7 41.66,32.13 38.73,32.13 37.72,33.15 37.72,35.94 38.02,36.25 CR1.2
MOSI_PI
  Top 0.254: U$5.SI 10.16,30.48 8.89,31.75 7.45,31.75 PCB1.P$19
N$1
  Top 0.254: C5.2 R11.2 R10.1
N$2
  Top 0.254: U1.4 54.35,55.75 54.61,56.01 R2.2
N$3
  Top 0.254: R1.1 56.46,45.98 D1.A
N$4
  Top 0.305: D2.A R15.1
N$5  (via drill 0.35)
  Top 0.305: R15.2 40.51,14.73 40.77,14.99 v40.77,17.65 | v41.27,20.45 41.27,21.89 arc-90 U$2.PB4
  Bottom 0.305: v40.77,17.65 40.77,19.94 arc-90 v41.27,20.45
N$6
  Top 0.254: C20.1 56.3,27.12 Y2.2 56.2,27.14 R7.1
N$7
  Top 0.254: C19.1 56.3,22.16 Y2.1 56.07,22.01 R9.1
NRST  (via drill 0.35)
  Top 0.254: v53.98,36.2 RESET1.2 51.72,35.73 R8.1 49.66,32.13 v48.39,30.86 | v48,25.78 46.76,25.78 U$2.NRST 46.71,25.78 45.85,25.78 45.72,25.65 45.72,22.99 46.86,21.84 46.86,19.81 45.34,18.29 42.67,18.29 42.04,17.65 SV2.2
  Bottom 0.254: C10.1 54.61,35.56 v53.98,36.2 | v48.39,30.86 48.39,26.16 v48,25.78
NSS  (via drill 0.35)
  Top 0.254: R5.2 44.58,39.5 42.6,37.52 CR1.1 38.66,37.52 v38.61,37.47 | v43.31,28.57 43.94,28.57 44.49,29.12 U$2.PA4
  Bottom 0.254: v38.61,37.47 38.61,33.15 39.12,32.64 39.12,29.21 39.75,28.57 v43.31,28.57
OSC1
  Top 0.254: U$5.OSC1 25.37,34.29 Y1.2 30.85,36.09 C18.1
OSC2
  Top 0.254: U$5.OSC2 25.37,33.02 Y1.1 C11.1
OSC_IN
  Top 0.254: U$2.PF0-OSC_IN 51.16,24.16 51.6,23.71 R9.2
OSC_OUT
  Top 0.254: R7.2 51.47,25.44 50.99,24.96 U$2.PF1-OSC_OUT
PI_CURRENT  (via drill 0.35)
  Top 0.254: v45.34,27.43 45.41,27.36 U$2.PA0
  Bottom 0.254: U$4.VIOUT 12.06,63.63 12.45,64.01 17.02,64.01 18.29,62.74 18.29,41.4 18.67,41.02 40.01,41.02 40.77,40.26 42.55,40.26 44.32,38.48 44.32,32 45.34,30.99 v45.34,27.43
SCK  (via drill 0.35)
  Top 0.254: v43.43,34.16 44.25,34.98 CR1.6 46.56,34.98 46.86,34.67 46.86,33.15 46.23,32.51 44.07,32.51 43.69,32.13 U$2.PA5
  Bottom 0.254: v43.43,34.16 43.42,34.15 R6.1
SCLK_PI
  Top 0.254: U$5.SCK 10.79,31.75 10.29,32.26 10.29,36.45 9.91,36.83 9.89,36.82 PCB1.P$23
SWCLK  (via drill 0.35)
  Top 0.254: U$2.PA14 43.45,23.36 v43.69,23.11
  Bottom 0.254: v43.69,23.11 43.69,17.02 SV2.3
SWDIO  (via drill 0.35)
  Top 0.254: U$2.PA13 43.92,24.16 v44.7,23.37
  Bottom 0.254: v44.7,23.37 44.7,19.43 47.12,17.02 SV2.4
USART_RX  (via drill 0.35)
  Top 0.254: PCB1.P$8 6.27,15.11 v12.45,15.11 | v35.69,10.67 37.34,12.32 37.34,13.84 38.35,14.86 38.35,18.16 39.12,18.92 43.18,18.92 43.69,19.43 U$2.PB7
  Bottom 0.254: v12.45,15.11 13.84,15.11 14.22,14.73 14.22,9.65 14.73,9.14 29.08,9.14 30.61,10.67 v35.69,10.67
USART_TX  (via drill 0.35)
  Top 0.254: PCB1.P$10 6.02,17.91 v12.45,17.91 | v35.69,12.07 36.45,12.83 36.45,14.99 37.59,16.13 37.59,18.29 38.99,19.68 42.16,19.68 42.89,20.41 U$2.PB6
  Bottom 0.254: v12.45,17.91 14.22,17.91 15.49,16.64 15.49,9.91 15.75,9.65 28.83,9.65 30.48,11.3 34.92,11.3 v35.69,12.07
VCC
  Bottom 0.813: C4.1 24.56,63.51
  Bottom 1.016: 24.56,63.51 24.55,63.5 22.35,63.5 21.02,64.83 J1.2 16.26,67.35 16.26,67.31 | C4.1 26.84,63.46 U2.3
  pour Bottom: 12.95,66.04 12.95,68.58 16.51,68.58 16.51,66.04

### Text on the board
tPlace: Data_Logger_rev1 / / Designed By: / Jacob Bobson / Sam Deghuee / Jason King